# EAGLE design usb card only (EAGLE 9.2.0)
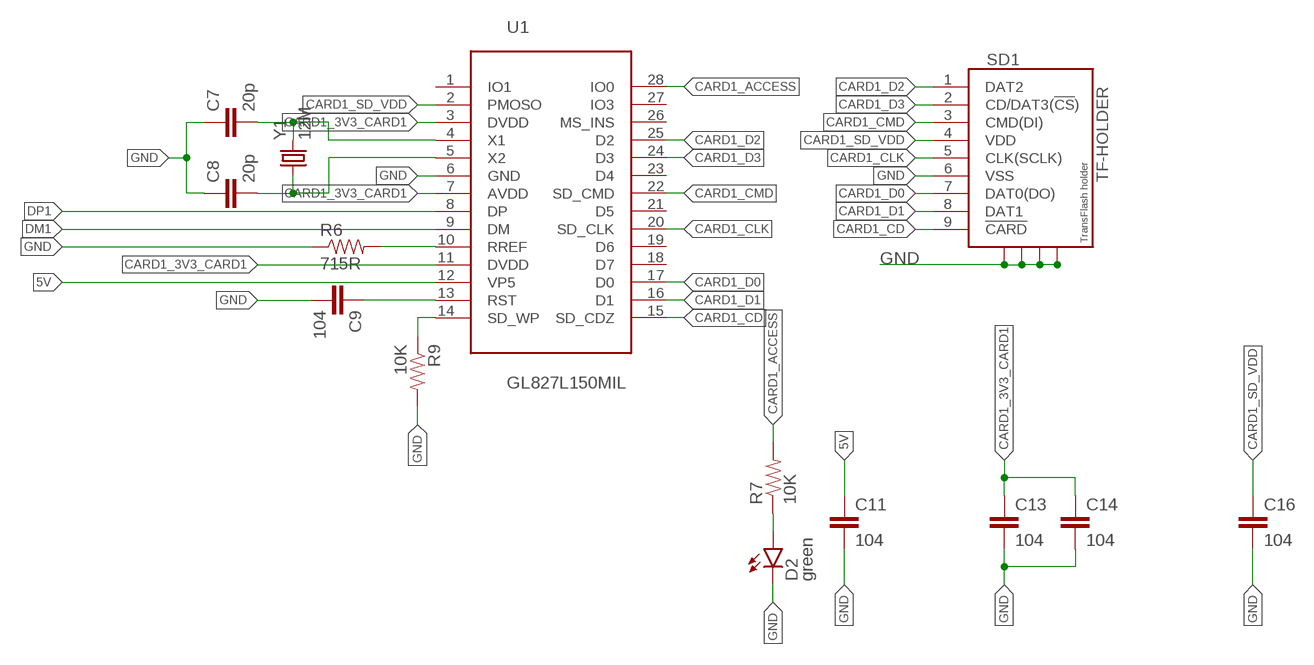
[diagram p0: schematic, sheet 1]

## Parts
C7  20p  CAP1206  [1206]
C8  20p  CAP1206  [1206]
C9  104  CAP1206  [1206]
C11  104  CAP1206  [1206]
C13  104  CAP1206  [1206]
C14  104  CAP1206  [1206]
C16  104  CAP1206  [1206]
D2  green  LED1206  [LED-1206]
R6  715R  RESISTOR1206  [1206]
R7  10K  RESISTOR1206  [1206]
R9  10K  RESISTOR1206  [1206]
SD1  TF-HOLDER  [TF-PULL]
U1  GL827L150MIL  [SSOP28-39]
Y1  12M  CRYSTAL2HC49US  [HC49US]

## Nets
5V: C11.1 U1.12(VP5)
CARD1_3V3_CARD1: C13.1 C14.1 U1.3(DVDD) U1.7(AVDD) U1.11(DVDD)
CARD1_ACCESS: R7.2 U1.28(IO0)
CARD1_CD: SD1.9(!CARD) U1.15(SD_CDZ)
CARD1_CLK: SD1.5(CLK(SCLK)) U1.20(SD_CLK)
CARD1_CMD: SD1.3(CMD(DI)) U1.22(SD_CMD)
CARD1_D0: SD1.7(DAT0(DO)) U1.17(D0)
CARD1_D1: SD1.8(DAT1) U1.16(D1)
CARD1_D2: SD1.1(DAT2) U1.25(D2)
CARD1_D3: SD1.2(CD/DAT3(!CS!)) U1.24(D3)
CARD1_SD_VDD: C16.1 SD1.4(VDD) U1.2(PMOSO)
DM1: U1.9(DM)
DP1: U1.8(DP)
GND: C7.1 C8.1 C9.2 C11.2 C13.2 C14.2 C16.2 D2.C R6.1 R9.2 SD1.6(VSS) SD1.S1 SD1.S2 SD1.S3 SD1.S4 U1.6(GND)
N$2: C7.2 U1.4(X1) Y1.2
N$5: C8.2 U1.5(X2) Y1.1
N$10: R6.2 U1.10(RREF)
N$21: C9.1 U1.13(RST)
N$26: D2.A R7.1
N$28: R9.1 U1.14(SD_WP)
Unconnected: U1.1(IO1) U1.18(D7) U1.19(D6) U1.21(D5) U1.23(D4) U1.26(MS_INS) U1.27(IO3)

## Library data of the parts
C7-C9 C11 C13 C14 C16 = z_jlc_smt:CAP: Capacitor Standard 0603 ceramic capacitor, and 0.1" leaded capacitor.
D2 = z_jlc_smt:LED: LEDs Standard schematic elements and footprints for 5mm, 3mm, 1206, and 0603 sized LEDs. 5mm - Spark Fun Electronics SKU : COM-00529 (and others)
R6 R7 R9 = z_jlc_smt:RESISTOR: Resistor Basic schematic elements and footprints for 0603, 1206, and PTH resistors.
SD1 = sd-mmc:TF-HOLDER: TF / Micro SD socket is PUSH-PUSH type, the card can be pushed into and auto locked and pushed out by simply press the card. Surface Mounting type.
U1 = xmgu2008:GL827L
Y1 = xmgu2008:CRYSTAL2: Various standard crystals. Proven footprints.

## Net classes
0 default: width 0.254 mm, clearance 0.152 mm
1 power: width 0.381 mm, clearance 0.254 mm

## Board
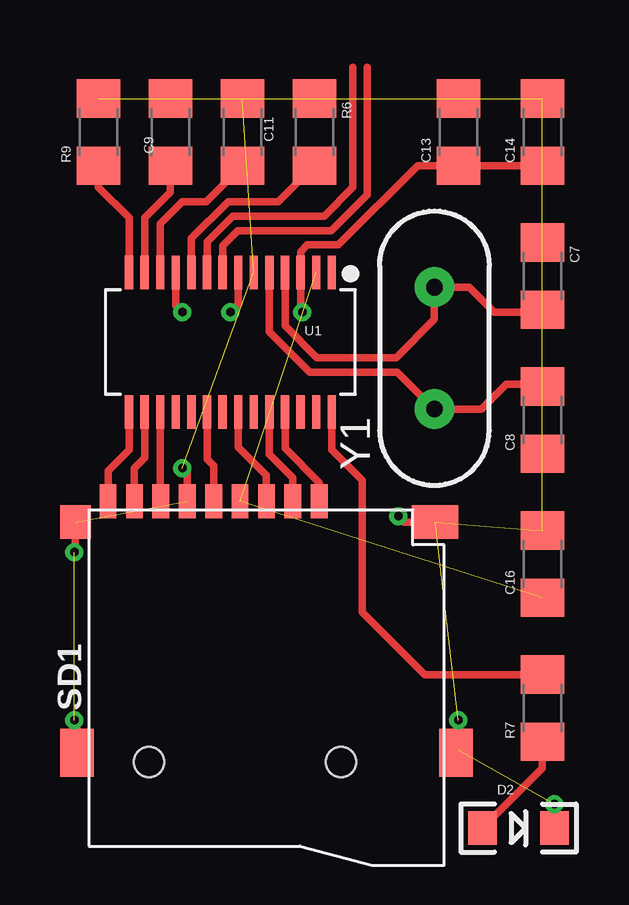
[diagram p1: board, top side]
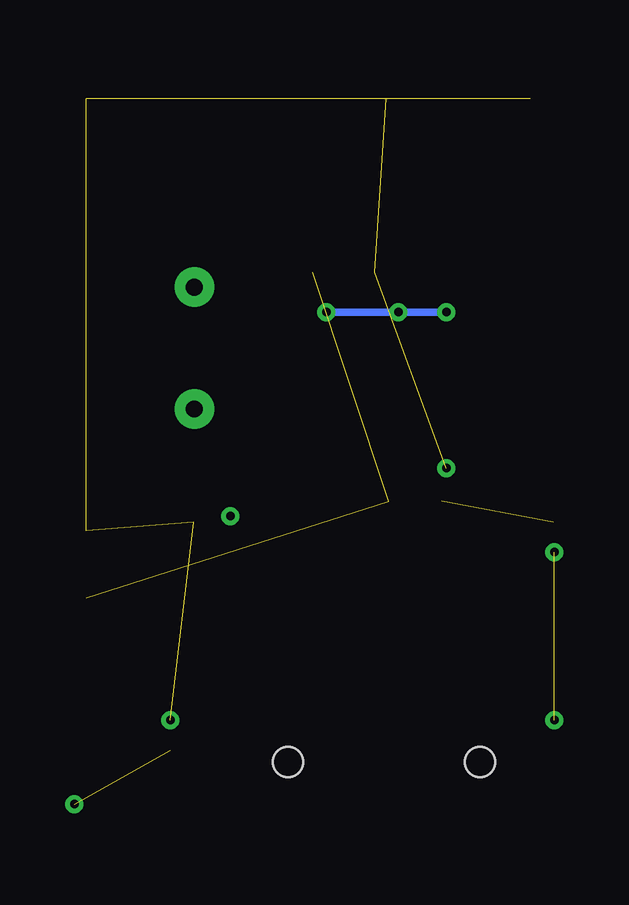
[diagram p2: board, bottom side, seen from below]

No outline drawn. Coordinates in mm, seen from the top.
Copper layers (1*16): Top 0.035mm / dielectric 1.5mm / Bottom 0.035mm
Design rules "default": minimum track width 6mil, minimum drill 0.35mm, track to track 6mil, track to pad 6mil, pad to pad 6mil, via to via 6mil, smd to smd 6mil, copper to edge 40mil, drill to drill 6mil, minimum pad ring 10mil, minimum via ring 8mil, stop-mask expansion 4mil, vias tented up to drill 0mil, thermal gap 10mil

### Footprints (pad centres in the part's own frame; a part is rotated, then mirrored left to right if it is on the bottom)
1206 = smd 1.6 x 1.8: 1 -1.4,0; 2 1.4,0
LED-1206 = smd 1.2 x 1.4: A -1.5,0; C 1.5,0
TF-PULL = smd 0.7 x 1.4: 1 -2.2,-7.62; 2 -1.1,-7.62; 3 0,-7.62; 4 1.1,-7.62; 5 2.2,-7.62; 6 3.3,-7.62; 7 4.4,-7.62; 8 5.5,-7.62; 9 6.6,-7.62 | smd 1.4 x 2: S1 -7.9,2.85; S2 7.9,2.85 | smd 1.28 x 1.4: S3 7.96,-6.75 | smd 1.95 x 1.4: S4 -7.025,-6.75 | hole 1.25: -3.1,3.25; 4.9,3.25
SSOP28-39 = smd 0.348 x 1.397: 1 -4.225,-3.656; 2 -3.575,-3.656; 3 -2.925,-3.656; 4 -2.275,-3.656; 5 -1.625,-3.656; 6 -0.975,-3.656; 7 -0.325,-3.656; 8 0.325,-3.656; 9 0.975,-3.656; 10 1.625,-3.656; 11 2.275,-3.656; 12 2.925,-3.656; 13 3.575,-3.656; 14 4.225,-3.656; 15 4.225,2.156; 16 3.575,2.156; 17 2.925,2.156; 18 2.275,2.156; 19 1.625,2.156; 20 0.975,2.156; 21 0.325,2.156; 22 -0.325,2.156; 23 -0.975,2.156; 24 -1.625,2.156; 25 -2.275,2.156; 26 -2.925,2.156; 27 -3.575,2.156; 28 -4.225,2.156
HC49US = drill 0.7 pad 1.651: 1 -2.54,0; 2 2.54,0

### Placement (x,y rotation side)
C7  66,-25 270 top
C8  66,-31 90 top
C9  50.5,-19 90 top
C11  53.5,-19 90 top
C13  62.5,-19 90 top
C14  66,-19 90 top
C16  66,-37 90 top
D2  65,-48 0 top
R6  56.5,-19 270 top
R7  66,-43 90 top
R9  47.5,-19 90 top
SD1  54.5,-42 180 top
U1  53,-28.5 180 top
Y1  61.5,-28 90 top

### Tracks (layer width: path | path; a pad name or v marks a point on that pad's centre or on a via)
5V
  Top 0.305: C11.1 52,-21.9 51,-21.9 50.08,-22.82 U1.12
CARD1_3V3_CARD1  (via drill 0.35)
  Top 0.305: v56,-26.5 55.92,-26.43 U1.3 55.92,-23.98 56.2,-23.7 57.5,-23.7 60.8,-20.4 C13.1 C14.1 | v51,-26.5 50.73,-26.23 U1.11 | U1.7 53.33,-26.18 v53,-26.5
  Bottom 0.305: v56,-26.5 v53,-26.5 v51,-26.5
CARD1_ACCESS
  Top 0.305: U1.28 57.23,-32.23 58.5,-33.5 58.5,-39 61.1,-41.6 R7.2
CARD1_CD
  Top 0.305: U1.15 48.77,-32.23 47.9,-33.1 SD1.9
CARD1_CLK
  Top 0.305: U1.20 52.02,-32.62 52.3,-32.9 SD1.5
CARD1_CMD
  Top 0.305: U1.22 53.33,-32.12 54.5,-33.3 SD1.3
CARD1_D0
  Top 0.305: U1.17 50.08,-34.35 SD1.7
CARD1_D1
  Top 0.305: U1.16 49.42,-32.58 49,-33 SD1.8
CARD1_D2
  Top 0.305: U1.25 55.27,-32.17 56.7,-33.6 SD1.1
CARD1_D3
  Top 0.305: U1.24 54.62,-32.42 55.6,-33.4 SD1.2
CARD1_SD_VDD  (2 unrouted)
DM1
  Top 0.305: U1.9 52.02,-23.57 53.1,-22.5 56.9,-22.5 58.1,-21.3 58.1,-16.3
DP1
  Top 0.305: U1.8 52.67,-23.73 53.3,-23.1 57.2,-23.1 58.7,-21.6 58.7,-16.3
GND  (via drill 0.35)  (15 unrouted)
  Top 0.305: D2.C v66.5,-47 | SD1.S1 62.5,-44.75 v62.5,-43.5 | SD1.S2 46.6,-43.6 v46.5,-43.5 | SD1.S4 60.25,-35.25 v60,-35 | SD1.S3 46.54,-36.46 v46.5,-36.5 | SD1.6 51.2,-33.2 v51,-33
N$2
  Top 0.305: U1.4 55.27,-27.07 56.6,-28.4 59.9,-28.4 61.5,-26.8 Y1.2 62.96,-25.46 64,-26.5 65.9,-26.5 C7.2
N$5
  Top 0.305: U1.5 54.62,-27.32 56.3,-29 59.96,-29 Y1.1 63.46,-30.54 64.5,-29.5 65.9,-29.5 C8.2
N$10
  Top 0.305: R6.2 55,-21.9 52.9,-21.9 51.38,-23.43 U1.10
N$21
  Top 0.305: U1.13 49.42,-22.57 50.5,-21.5 C9.1
N$26
  Top 0.305: R7.1 66,-45.5 D2.A
N$28
  Top 0.305: U1.14 48.77,-22.57 47.5,-21.3 R9.1